# EAGLE schematic dm_out (EAGLE 6.6.0)
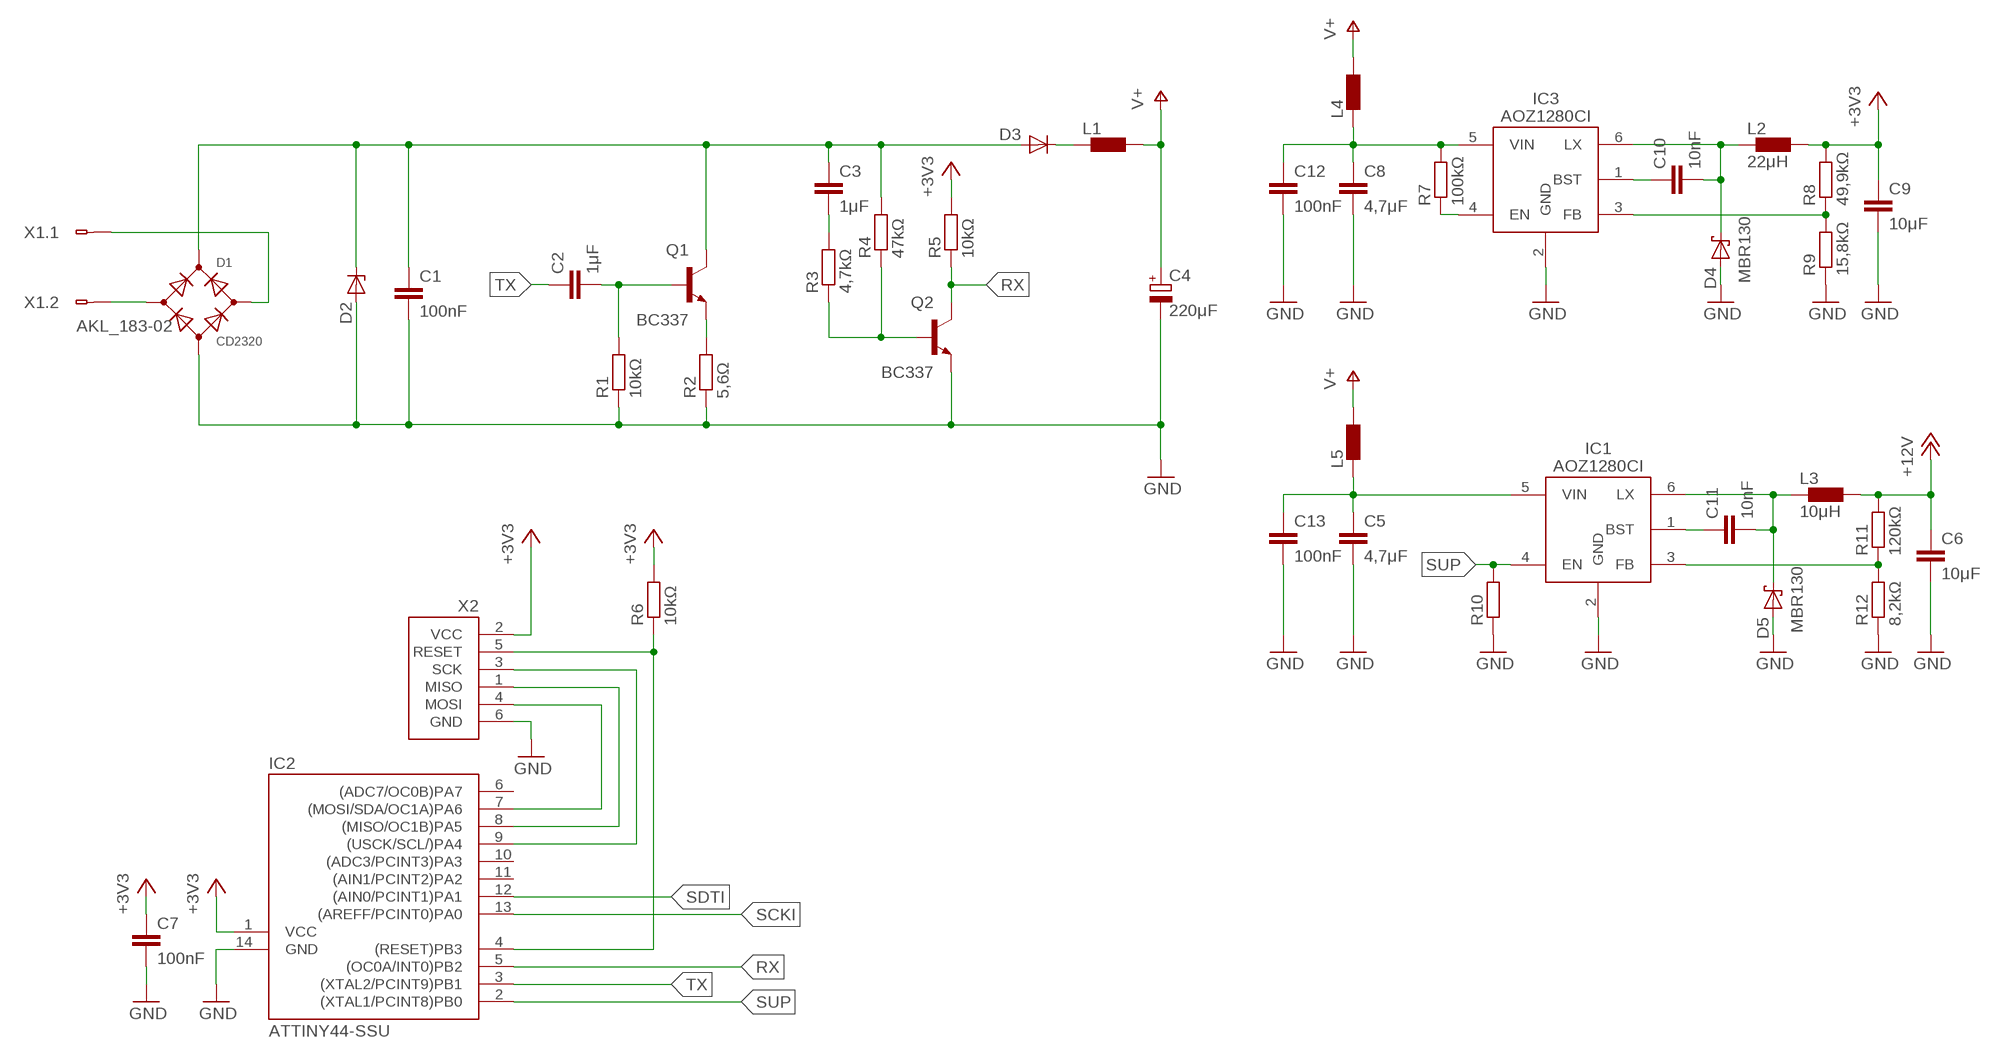
[diagram p0: schematic, sheet 1]

## Parts
C1  100nF  C_1206  [CHIP_1206]
C2  1μF  C_1206  [CHIP_1206]
C3  1μF  C_1206  [CHIP_1206]
C4  220μF  C_EL_E5-13  [E5-13]
C5  4,7μF  C_1206  [CHIP_1206]
C6  10μF  C_1206  [CHIP_1206]
C7  100nF  C_0603  [CHIP_0603]
C8  4,7μF  C_1206  [CHIP_1206]
C9  10μF  C_1206  [CHIP_1206]
C10  10nF  C_0603  [CHIP_0603]
C11  10nF  C_0603  [CHIP_0603]
C12  100nF  C_0805  [CHIP_0805]
C13  100nF  C_0805  [CHIP_0805]
D1  CD2320  [2320]
D2  Z-DIODE-SOD123  [SOD123]
D3  DIODE-SOD123  [SOD123]
D4  MBR130  SHOTKY-DIODE-SOD123  [SOD123]
D5  MBR130  SHOTKY-DIODE-SOD123  [SOD123]
IC1  AOZ1280CI  [SOT23-6_095]
IC2  ATTINY44-SSU  [SOP14_127]
IC3  AOZ1280CI  [SOT23-6_095]
L1  L_0805  [CHIP_0805]
L2  22μH  L_0805  [CHIP_0805]
L3  10μH  L_1210  [CHIP_1210]
L4  L_0805  [CHIP_0805]
L5  L_0805  [CHIP_0805]
Q1  BC337  NPN-SOT23-BEC  [SOT23]
Q2  BC337  NPN-SOT23-BEC  [SOT23]
R1  10kΩ  R_0603  [CHIP_0603]
R2  5,6Ω  R_1206  [CHIP_1206]
R3  4,7kΩ  R_0603  [CHIP_0603]
R4  47kΩ  R_0603  [CHIP_0603]
R5  10kΩ  R_0603  [CHIP_0603]
R6  10kΩ  R_0603  [CHIP_0603]
R7  100kΩ  R_0603  [CHIP_0603]
R8  49,9kΩ  R_0603  [CHIP_0603]
R9  15,8kΩ  R_0603  [CHIP_0603]
R10  R_0603  [CHIP_0603]
R11  120kΩ  R_0603  [CHIP_0603]
R12  8,2kΩ  R_0603  [CHIP_0603]
X1  AKL_183-02  [AKL_183-02]
X2  ISP-AVR6  [ML6]

## Nets
+3V3: C7.1 C9.1 IC2.1(VCC) L2.1 R5.2 R6.2 R8.2 X2.2(VCC)
+12V: C6.1 L3.1 R11.2
GND: C1.2 C4.- C5.2 C6.2 C7.2 C8.2 C9.2 C12.2 C13.2 D1.- D2.A D4.A D5.A IC1.2(GND) IC2.14(GND) IC3.2(GND) Q2.2(E) R1.1 R2.1 R9.1 R10.1 R12.1 X2.6(GND)
N$1: IC2.8((MISO/OC1B)PA5) X2.1(MISO)
N$2: IC2.7((MOSI/SDA/OC1A)PA6) X2.4(MOSI)
N$3: D3.K L1.2
N$4: IC2.9((USCK/SCL/)PA4) X2.3(SCK)
N$5: IC2.4((RESET)PB3) R6.1 X2.5(RESET)
N$6: IC3.4(EN) R7.1
N$7: C10.1 IC3.1(BST)
N$8: C10.2 D4.K IC3.6(LX) L2.2
N$9: IC3.3(FB) R8.1 R9.2
N$10: C8.1 C12.1 IC3.5(VIN) L4.2 R7.2
N$11: C11.1 IC1.1(BST)
N$12: C11.2 D5.K IC1.6(LX) L3.2
N$13: IC1.3(FB) R11.1 R12.2
N$14: C5.1 C13.1 IC1.5(VIN) L5.2
N$16: Q1.2(E) R2.2
N$17: C2.2 Q1.1(B) R1.2
N$18: Q2.1(B) R3.1 R4.1
N$19: C3.2 R3.2
N$20: D1.AC2 X1.1
N$22: D1.AC1 X1.2
RX: IC2.5((OC0A/INT0)PB2) Q2.3(C) R5.1
SCKI: IC2.13((AREFF/PCINT0)PA0)
SDTI: IC2.12((AIN0/PCINT1)PA1)
SUP: IC1.4(EN) IC2.2((XTAL1/PCINT8)PB0) R10.2
TX: C2.1 IC2.3((XTAL2/PCINT9)PB1)
V+: C4.+ L1.1 L4.1 L5.1
VCC: C1.1 C3.1 D1.+ D2.K D3.A Q1.3(C) R4.2
Unconnected: IC2.6((ADC7/OC0B)PA7) IC2.10((ADC3/PCINT3)PA3) IC2.11((AIN1/PCINT2)PA2)

## Library data of the parts
C1-C3 C5-C13 = passiv:C_: CAPACITOR, European symbol
C4 = passiv:C_EL_: POLARIZED CAPACITOR, European symbol
D1 = gleichrichter:CD2320: SMD Gleichrichter Datasheet: cd2320.pdf <./eagle/doc/gleichrichter/cd2320.pdf>
D2 = diode:Z-DIODE
D3 = diode:DIODE
D4 D5 = diode:SHOTKY-DIODE
IC1 IC3 = ic-dc_dc:AOZ1280CI: Stepdown Wandler Datasheet: aoz1280ci.pdf <./eagle/doc/ic-dc_dc/aoz1280ci.pdf>
IC2 = ic-mcu:ATTINY44: Microcontroller Typ Flash SRAM EEPROM GPIO ADC DAC PWM Timer Ports ATtiny44A <./eagle/doc/ic-mcu/attiny24a_44a.pdf> 4kB 256B 256B 12 8x 10bit 2x 8bit 1x 8bit, 1x 16bit USI
L1-L5 = passiv:L_: INDUCTOR, European symbol
Q1 Q2 = transistor:NPN: NPN Transistor Typ Variant VCEO (V) IC (mA) PD (mW) Source BC337 TO92x-EBC 45 800 625 bc337_338.pdf <./eagle/doc/transistor/bc337_338.pdf> BC546 TO92x-EBC 65 100 625 bc546.pdf <./eagle/doc/transistor/bc546.pdf> BC817 SOT23-BEC 45 500 250 bc817.pdf <./eagle/doc/transistor/bc817.pdf> BD543 TO220x-BCE 40 10A 70W bd543.pdf <./eagle/doc/transistor/bd543.pdf>
R1-R12 = passiv:R_: RESISTOR, European symbol
X1 = anschluss:AKL_183-02: Anschlussklemme Datasheet: akl181-183.pdf <./eagle/doc/anschluss/akl181-183.pdf> Gegenstück: AKL169
X2 = stecker:ISP